# EAGLE design BLSpkAlwaysOnRobotV2 (EAGLE 9.7.0)

## Sheet 1 of 2
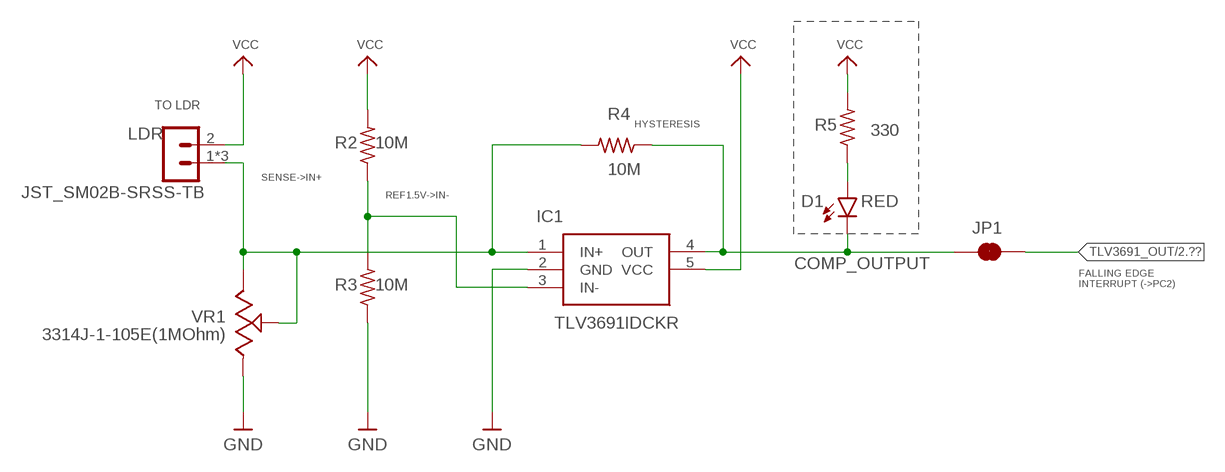
[diagram p0: schematic, sheet 1]

### Parts
D1  RED  LED_06030603  [LED-0603]
IC1  TLV3691IDCKR  [SOT65P210X110-5N]
JP1  JUMPER_SHORTED_NO-SILK  [JUMPER_SHORTED]
LDR  JST_SM02B-SRSS-TB  [JST_SM02B-SRSS-TB]
R2  10M  R-US-0603_CHIP-0603(1608-METRIC)  [RESC1608X60]
R3  10M  R-US-0603_CHIP-0603(1608-METRIC)  [RESC1608X60]
R4  10M  R-US-0603_CHIP-0603(1608-METRIC)  [RESC1608X60]
R5  330  R-US-0603_CHIP-0603(1608-METRIC)  [RESC1608X60]
VR1  3314J-1-105E(1MOhm)  3314J-1-105E  [TRIM_3314J-1-105E]

### Nets
COMP_OUTPUT: D1.C IC1.4(OUT) JP1.1 R4.1
GND: IC1.2(GND) R3.1 VR1.1(CCW) ; also sheet 2
N$1: D1.A R5.1
REF1.5V->IN-: IC1.3(IN-) R2.1 R3.2
SENSE->IN+: IC1.1(IN+) LDR.1 LDR.M1 LDR.M2 R4.2 VR1.2(WIPER) VR1.3(CW)
TLV3691_OUT: JP1.2 ; also sheet 2
VCC: IC1.5(VCC) LDR.2 R2.2 R5.2 ; also sheet 2

### Notes on the sheet
- TO LDR
- HYSTERESIS
- FALLING EDGE
  INTERRUPT (->PC2)

## Sheet 2 of 2
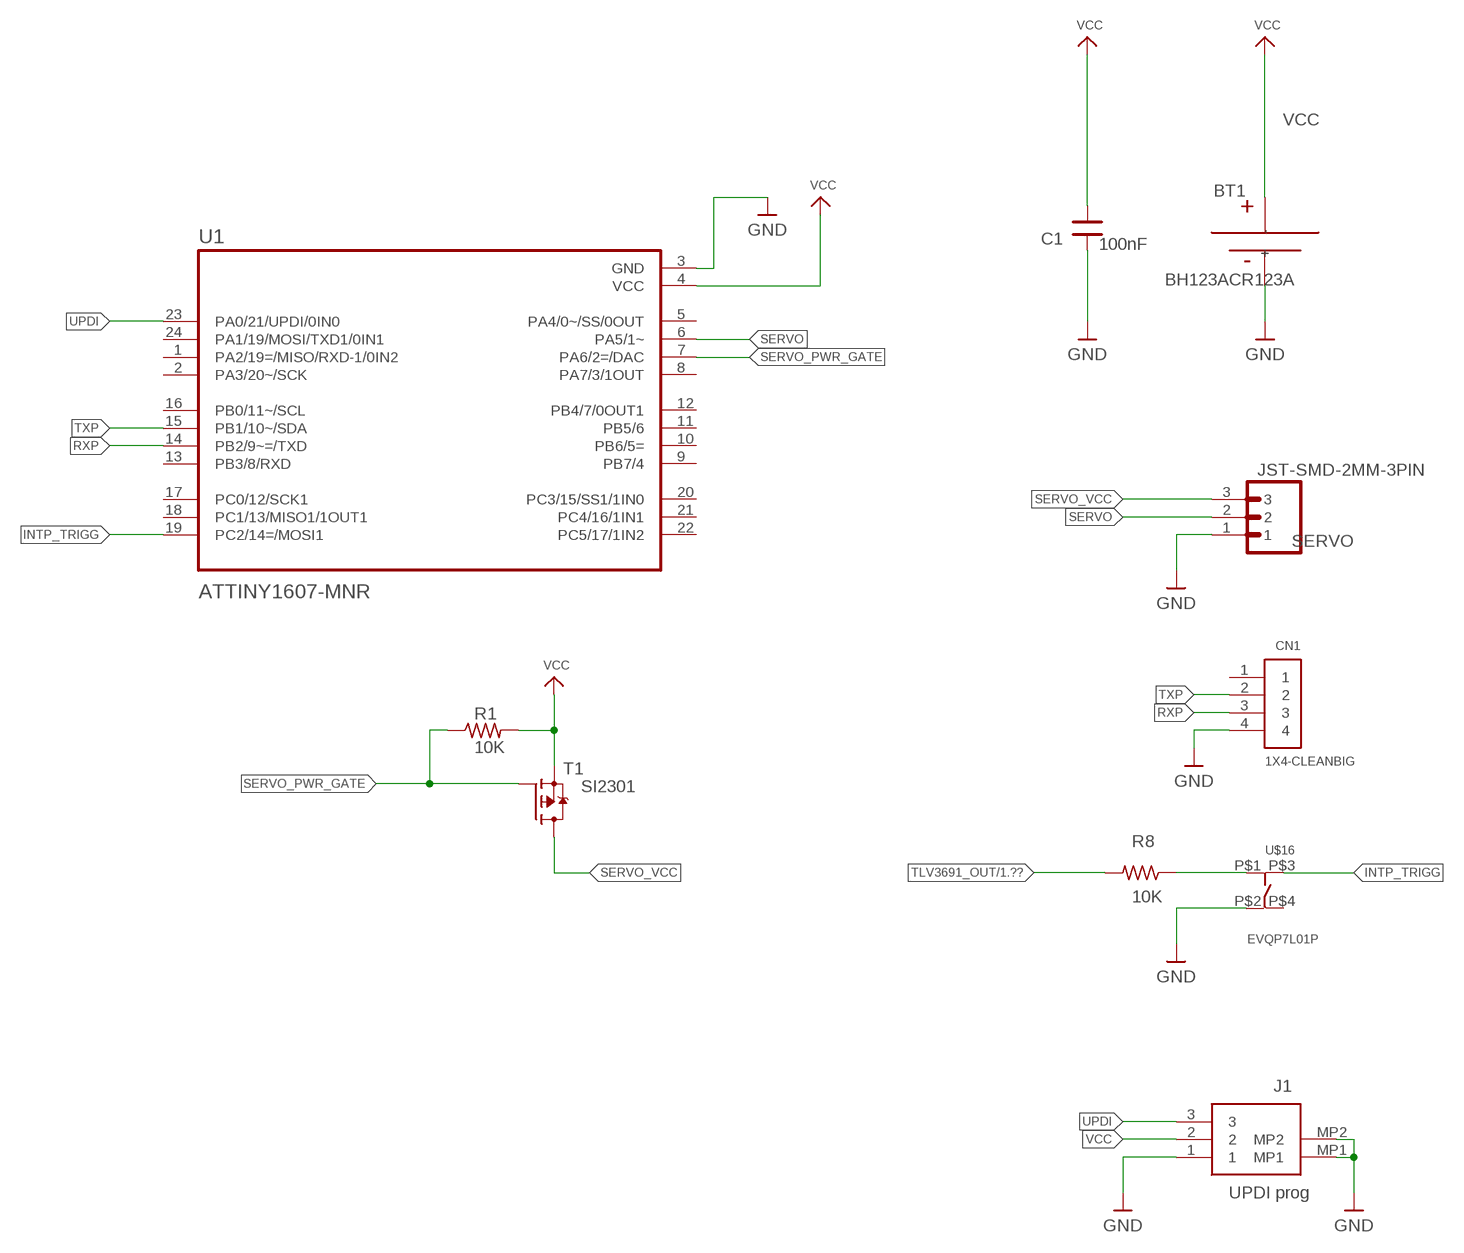
[diagram p1: schematic, sheet 2]

### Parts
BT1  BH123ACR123A  [BH123A]
C1  100nF  C_CHIP-0603(1608-METRIC)  [CAPC1608X85]
CN1  1X4-CLEANBIG  [1X04-CLEANBIG]
J1  UPDI prog  SM03B-SRSS-TB_LF__SN_  [SM03BSRSSTBLFSN]
R1  10K  R-US-0603_CHIP-0603(1608-METRIC)  [RESC1608X60]
R8  10K  R-US-0603_CHIP-0603(1608-METRIC)  [RESC1608X60]
SERVO  JST-SMD-2MM-3PIN  [JST-SMD-2MM-3PIN]
T1  SI2301  [SI2301_DESTO_SOT23]
U1  ATTINY1607-MNR  [QFN50P400X400X90-25N]
U$16  EVQP7L01P  [EVQP7L01P]

### Nets
GND: BT1.- C1.1 CN1.4 J1.1 J1.MP1 J1.MP2 SERVO.1 U1.3(GND) U$16.P$2 ; also sheet 1
INTP_TRIGG: U1.19(PC2/14=/MOSI1) U$16.P$3
N$3: R8.1 U$16.P$1
RXP: CN1.3 U1.14(PB2/9~=/TXD)
SERVO: SERVO.2 U1.6(PA5/1~)
SERVO_PWR_GATE: R1.1 T1.1(G) U1.7(PA6/2=/DAC)
SERVO_VCC: SERVO.3 T1.3(D)
TLV3691_OUT: R8.2 ; also sheet 1
TXP: CN1.2 U1.15(PB1/10~/SDA)
UPDI: J1.3 U1.23(PA0/21/UPDI/0IN0)
VCC: BT1.+ C1.2 J1.2 R1.2 T1.2(S) U1.4(VCC) ; also sheet 1
Unconnected: CN1.1 U1.1(PA2/19=/MISO/RXD-1/0IN2) U1.2(PA3/20~/SCK) U1.5(PA4/0~/SS/0OUT) U1.8(PA7/3/1OUT) U1.9(PB7/4) U1.10(PB6/5=) U1.11(PB5/6) U1.12(PB4/7/0OUT1) U1.13(PB3/8/RXD) U1.16(PB0/11~/SCL) U1.17(PC0/12/SCK1) U1.18(PC1/13/MISO1/1OUT1) U1.20(PC3/15/SS1/1IN0) U1.21(PC4/16/1IN1) U1.22(PC5/17/1IN2) U1.24(PA1/19/MOSI/TXD1/0IN1) U$16.P$4

## Library data of the parts
BT1 = BLSpeakerAlwaysOnRobot:BH123A: collection of battery footprints
C1 = BLSpeakerAlwaysOnRobot:C: Capacitor - Generic
CN1 = adafruit:1X4: 4-pin connector
D1 = BLSpeakerAlwaysOnRobot:LED_0603: Green SMD LED Used in manufacturing of various products at SparkFun Packages: 0603 - SMD 0603 package [Product Link] <http://www.futureelectronics.com/en/technologies/semiconductors/optoelectronics/leds/Pages/9894312-LTST-C190GKT.aspx?CrossPart=HSMG-C190&IM=0> LilyPad 1206 - SMD1206 LilyPad package [Product Link] <http://www.futureelectronics.com/en/Technologies/Product.aspx?ProductID=IN150NGHARVATEKCORPORATION2049943&IM=0> 1206 - SMD1206 package [Product Link] <http://www.futureelectronics.com/en/technologies/semiconductors/optoelectronics/leds/Pages/8315665-LTST-C150KGKT.aspx?IM=0> 1206 Bottom Mount -SMD 1206 Bottom Mount [Product Link] <http://www.digikey.com/product-detail/en/lite-on-inc/LTST-C230KGKT/160-1456-1-ND/386854> SparkFun Products: Pro Mini 328 -5V <https://www.sparkfun.com/products/821> RedBoard <https://www.sparkfun.com/products/12757> MP3 Trigger <https://www.sparkfun.com/products/13720> Makey Makey <https://www.sparkfun.com/products/11076>
IC1 = BLSpeakerAlwaysOnRobot:TLV3691IDCKR: Lowest Power, 0.9V to 6.5V, Small Size Comparator Source: Datasheet <http://www.ti.com/lit/gpn/tlv3691>
J1 = BLSpeakerAlwaysOnRobot:SM03B-SRSS-TB_LF__SN_: Wire To Board / Wire To Wire Connector RoHS Source: Datasheet <http://www.jst-mfg.com/product/pdf/eng/eSR.pdf>
JP1 = BLSpeakerAlwaysOnRobot:JUMPER_SHORTED: Normally closed trace jumper This jumper has a trace between two pads so it's normally closed (NC). Use a razor knife to open the connection. For best results follow the IPC guidelines for cutting traces: Cutout at least 0.063 mm (0.005 in). Remove all loose material to clean up the cut area. Seal the cut with an approved epoxy. Reapply solder to reclose the connection.
LDR = BLSpeakerAlwaysOnRobot:JST_SM02B-SRSS-TB
R1-R5 R8 = BLSpeakerAlwaysOnRobot:R-US-0603: Resistor Fixed - ANSI
SERVO = BLSpeakerAlwaysOnRobot:JST-SMD-2MM-3PIN
T1 = BLSpeakerAlwaysOnRobot:SI2301: Check availability <https://pricing.snapeda.com/parts/SI2301/Vishay%20Siliconix/view-part?ref=eda>
U1 = BLSpeakerAlwaysOnRobot:ATTINY1607-MNR: None Check prices <https://pricing.snapeda.com/parts/ATTINY1607-MNR/Microchip%20Technology/view-part?ref=eda>
U$16 = MY_BUTTONS:EVQP7L01P
VR1 = BLSpeakerAlwaysOnRobot:3314J-1-105E

## Board
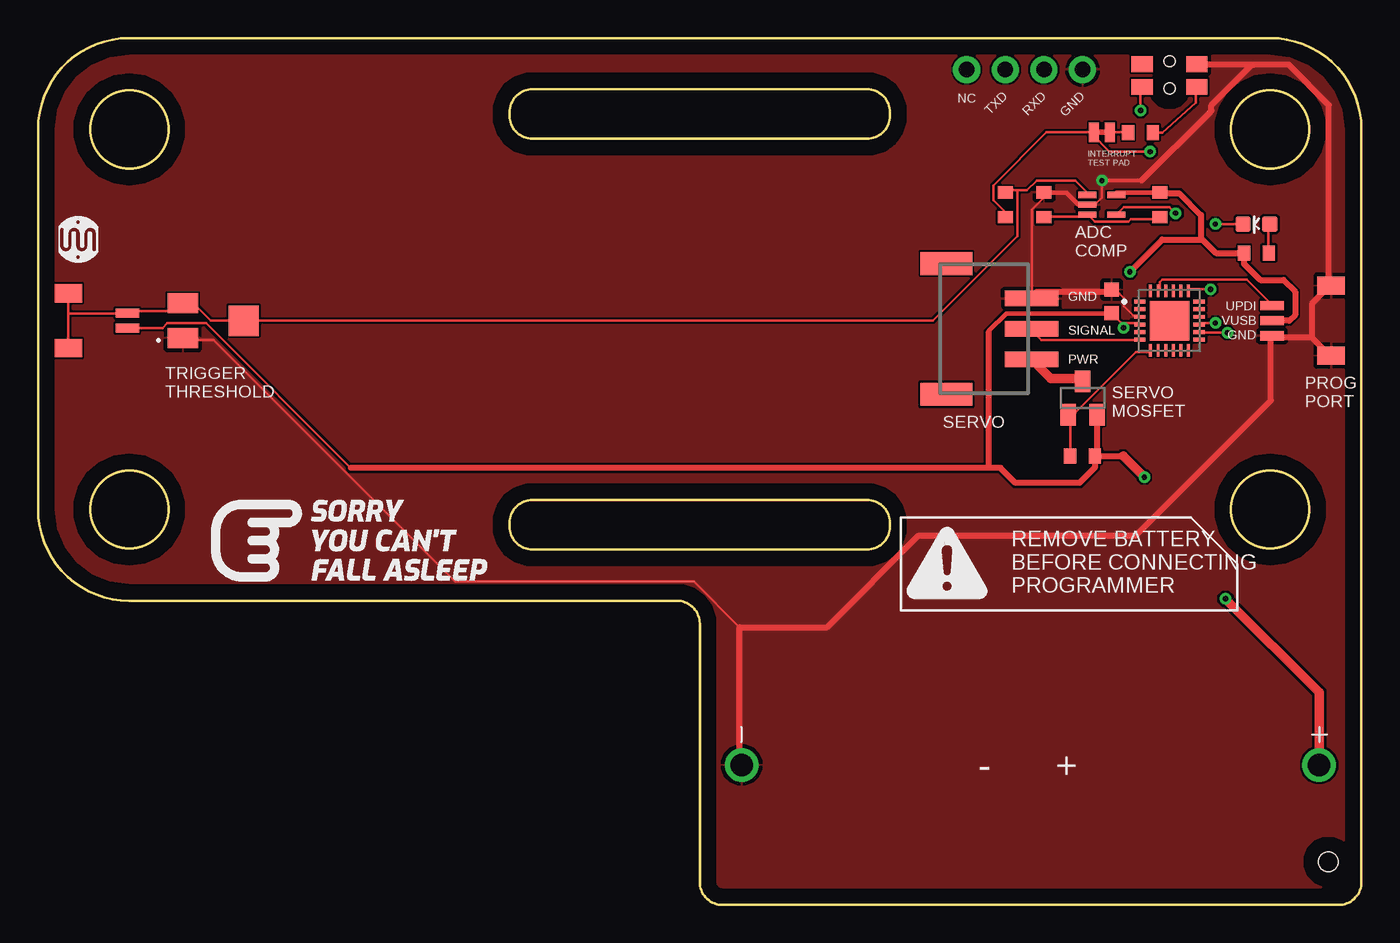
[diagram p2: board, top side]
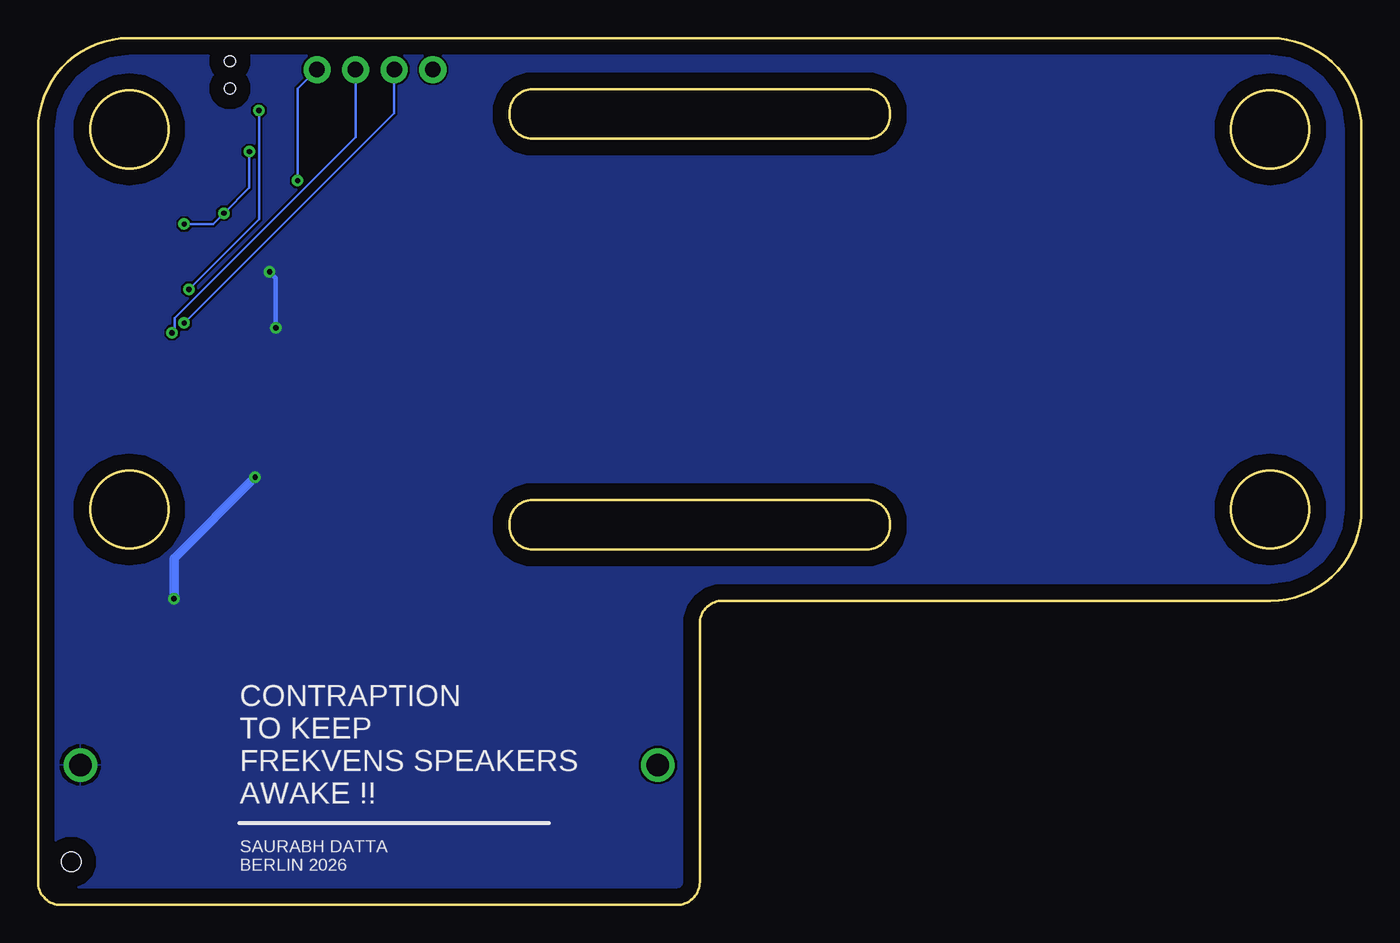
[diagram p3: board, bottom side, seen from below]

Size 87 x 57 mm. Coordinates in mm from the lower left corner, seen from the top.
Outline: 31,51.87 arc90 32.5,50.37 54.5,50.37 arc90 56,51.87 56,52.12 arc90 54.5,53.62 32.5,53.62 arc90 31,52.12 31,51.87
Outline: 32.5,26.62 arc90 31,25.12 31,24.87 arc90 32.5,23.37 54.5,23.37 arc90 56,24.87 56,25.12 arc90 54.5,26.62 32.5,26.62
Outline: 43.5,1.5 arc90 45,0 85.5,0 arc90 87,1.5 87,51 arc90 81,57 6,57 arc90 0,51 0,26 arc90 6,20 42,20 arc-90 43.5,18.5 43.5,1.5
Outline: circle at 81,51 radius 2.56
Outline: circle at 6,26 radius 2.56
Outline: circle at 6,51 radius 2.56
Outline: circle at 81,26 radius 2.56
Copper layers (1*16): Top / Bottom
Stack-up Default Layer Stack: Top SilkScreen Epoxy Ink / Top SolderMask User Defined 0.0254mm Dk 4.3 / Top Surface Finish Lead-Free 0.02mm / Top CuFoil:007 0.035mm / Dielectric-1 User Defined 1.5mm / Bottom CuFoil:007 0.035mm / Bottom Surface Finish Lead-Free 0.02mm / Bottom SolderMask User Defined 0.0254mm Dk 4.3 / Bottom SilkScreen Epoxy Ink
Design rules: minimum drill size 0.35mm, minimum copper width 6mil, keepout clearance 0mil, drill distance 6mil, via restrict clearance 0mil, dimension clearance 40mil, restrict clearance 0mil, copper clearance wire_polygon to wire_polygon 6mil, copper clearance wire_polygon to pad_smd 6mil, copper clearance wire_polygon to via 6mil, copper clearance pad_smd to pad_smd 6mil, copper clearance pad_smd to via 6mil, copper clearance via to via 6mil, copper clearance smd to pad (same net) 6mil, copper clearance smd to via (same net) 6mil, copper clearance smd to smd (same net) 6mil

### Footprints (pad centres in the part's own frame; a part is rotated, then mirrored left to right if it is on the bottom)
BH123A = drill 1.47: + 18.985,0; - -18.985,0 | hole 1.27: 19.58,-6.37
CAPC1608X85 = smd 0.921 x 0.97: 1 -0.775,0; 2 0.775,0
1X04-CLEANBIG = drill 1.016 pad 1.778: 1 -3.81,0; 2 -1.27,0; 3 1.27,0; 4 3.81,0
LED-0603 = smd 1 x 1: A -0.877,0; C 0.877,0
SOT65P210X110-5N = smd 1.2 x 0.4: 1 -0.95,0.65; 2 -0.95,0; 3 -0.95,-0.65; 4 0.95,-0.65; 5 0.95,0.65
SM03BSRSSTBLFSN = smd 0.6 x 1.55: 1 -1,2.463; 2 0,2.463; 3 1,2.463 | smd 1.2 x 1.8: MP1 -2.3,-1.413; MP2 2.3,-1.413
JUMPER_SHORTED = smd 0.66 x 1.27: 1 -0.521,0; 2 0.521,0
JST_SM02B-SRSS-TB = smd 0.6 x 1.55: 1 0.5,0; 2 -0.5,0 | smd 1.2 x 1.8: M1 1.8,3.875; M2 -1.8,3.875
RESC1608X60 = smd 0.799 x 0.974: 1 -0.815,0; 2 0.815,0
JST-SMD-2MM-3PIN = smd 1 x 3.5: 1 -4,3; 2 -2,3; 3 0,3 | smd 1.5 x 3.4: P$1 -6.3,-2.6; P$2 2.3,-2.6
SI2301_DESTO_SOT23 = smd 1 x 1.4: 1 -0.95,-1.1; 2 0.95,-1.1; 3 0,1.1
QFN50P400X400X90-25N = smd 0.81 x 0.26: 1 -1.95,1.25; 2 -1.95,0.75; 3 -1.95,0.25; 4 -1.95,-0.25; 5 -1.95,-0.75; 6 -1.95,-1.25; 13 1.95,-1.25; 14 1.95,-0.75; 15 1.95,-0.25; 16 1.95,0.25; 17 1.95,0.75; 18 1.95,1.25 | smd 0.26 x 0.81: 7 -1.25,-1.95; 8 -0.75,-1.95; 9 -0.25,-1.95; 10 0.25,-1.95; 11 0.75,-1.95; 12 1.25,-1.95; 19 1.25,1.95; 20 0.75,1.95; 21 0.25,1.95; 22 -0.25,1.95; 23 -0.75,1.95; 24 -1.25,1.95 | smd 2.6 x 2.6: 25 0,0
EVQP7L01P = smd 1.4 x 1.05: P$1 -1.8,0.8; P$2 -1.8,-0.71; P$3 1.8,0.8; P$4 1.8,-0.71 | hole 0.7: 0,0.9; 0,-0.9
TRIM_3314J-1-105E = smd 1.3 x 2: 1 1.15,-2; 3 -1.15,-2 | smd 2 x 2: 2 0,2

### Placement (x,y rotation side)
BT1  65.24,9.21 0 top
C1  70.57,39.69 270 top
CN1  64.86,54.93 0 top
D1  80.1,44.77 180 top
IC1  69.94,46.04 0 top
J1  83.59,38.42 90 top
JP1  69.94,50.8 0 top
LDR  5.87,38.42 90 top
R1  68.67,29.53 0 top
R2  73.75,46.04 90 top
R3  66.13,46.04 270 top
R4  63.59,46.04 90 top
R5  80.1,42.86 180 top
R8  72.48,50.78 180 top
SERVO  62.32,35.88 270 top
T1  68.67,33.34 0 top
U1  74.38,38.42 0 top
U$16  74.38,54.58 180 top
VR1  11.52,38.42 270 top

### Tracks (layer width: path | path; a pad name or v marks a point on that pad's centre or on a via)
COMP_OUTPUT  (via drill 0.35)
  Top 0.152: D1.C v77.4,44.77 | IC1.4 70.89,45.4 71.36,45.88 74.38,45.88 v74.78,45.48 | R4.1 63.59,45.56 62.79,46.35 62.79,47.31 66.28,50.8 69.3,50.8 | v73.11,49.53 70.44,49.53 69.3,50.67 69.3,50.8 | JP1.1 69.3,50.8
  Bottom 0.152: v77.4,44.77 75.49,44.77 v74.78,45.48 73.11,47.15 v73.11,49.53
GND  (via drill 0.35)
  Top 0.152: 68.51,46.04 IC1.2 69.46,46.04 69.94,46.51 v69.94,47.63 | U1.3 72.32,38.73 72,38.73 71.36,39.37 71.36,39.91 71.08,40.2 70.7,40.2 70.57,40.32 C1.1 | 65.33,40.01 65.65,40.32 | 65.33,40.01 65.33,45.72 66.13,46.51 66.13,46.83 R3.1 | 65.33,40.01 SERVO.1 | 81.21,37.31 J1.1 81.05,37.31 | 84.86,36.19 J1.MP1 | 76.29,55.25 U$16.P$2 | 84.86,40.8 J1.MP2 84.86,40.64 | 46.12,18.26 43.11,21.27 27.41,21.27 11.54,37.15 9.61,37.15 VR1.1 | 46.12,9.21 BT1.-
  Top 0.254: 72.54,47.63 v69.94,47.63
  Top 0.305: 66.13,46.83 67.61,46.83 68.4,46.04 68.51,46.04
  Top 0.406: 65.65,40.32 70.57,40.32 | 83.75,37.31 81.21,37.31 | 84.86,36.19 83.75,37.31 | 79.79,55.25 76.29,55.25 | 83.75,37.31 83.75,39.53 84.86,40.64 | 46.12,9.21 46.12,18.26 51.85,18.26 57.88,24.29 72.16,24.29 81.05,33.18 81.05,37.31 | 84.86,40.8 84.86,52.6 82.21,55.25 79.97,55.25 79.79,55.25 | 72.54,47.63 76.98,52.07 77.14,52.23 77.14,52.6 79.79,55.25
  Bottom 0.152: CN1.4 69.94,53.66 v69.94,47.63
  pour Top: -2.45,61.28 88.99,61.28 88.99,-6.03 39.46,-6.03 39.46,16.83 -2.45,16.83
INTP_TRIGG  (via drill 0.35)
  Top 0.152: v77.08,40.48 75.65,40.48 U1.19 | v72.48,52.23 72.48,53.66 U$16.P$3
  Bottom 0.152: v77.08,40.48 72.48,45.08 v72.48,52.23
N$1
  Top 0.152: R5.1 80.89,42.86 80.89,44.77 D1.A
N$3
  Top 0.152: R8.1 73.92,50.78 76.13,52.74 76.13,53.66 U$16.P$1
REF1.5V->IN-
  Top 0.152: R3.2 66.13,45.24 68.98,45.24 IC1.3 69.14,45.24 69.46,44.93 71.68,44.93 71.84,45.08 73.75,45.08 R2.1
RXP  (via drill 0.35)
  Top 0.152: v78.19,37.62 76.44,37.62 U1.14
  Bottom 0.152: v78.19,37.62 78.03,37.78 78.03,38.58 66.13,50.48 CN1.3
SENSE->IN+
  Top 0.152: 1.99,38.89 1.99,40.16 LDR.M1 | 1.99,38.89 1.99,36.67 LDR.M2 | 64.38,46.99 65.01,46.99 65.65,47.63 68.19,47.63 68.98,46.83 IC1.1 | 64.38,46.99 63.59,46.99 R4.2 | 64.38,46.99 64.38,43.97 58.82,38.42 VR1.2 11.36,38.42 10.25,39.53 9.61,39.53 VR1.3 9.45,39.53 8.98,39.05 5.96,39.05 LDR.1 5.8,38.89 1.99,38.89
SERVO
  Top 0.152: U1.6 72.32,37.15 65.97,37.15 65.33,37.78 SERVO.2
SERVO_PWR_GATE
  Top 0.152: U1.7 73.11,36.35 72.16,36.35 68.19,32.39 67.87,32.39 T1.1 67.87,32.23 67.87,29.53 R1.1
SERVO_VCC
  Top 0.61: T1.3 68.5,34.61 66.59,34.61 SERVO.3
TLV3691_OUT
  Top 0.152: R8.2 71.64,50.8 JP1.2
TXP  (via drill 0.35)
  Top 0.152: v77.4,38.26 76.44,38.26 U1.15
  Bottom 0.152: v77.4,38.26 63.59,52.07 CN1.2
UPDI
  Top 0.152: U1.23 73.75,40.48 73.75,40.96 73.9,41.12 79.46,41.12 81.05,39.53 J1.3
VCC  (via drill 0.35)
  Top 0.152: 70.89,46.83 IC1.5 | 73.75,46.83 R2.2 | 71.36,38.26 71.21,38.26 70.57,38.89 C1.2 | 71.36,38.26 72.32,38.26 U1.4 | 20.56,28.73 11.04,38.26 8.5,38.26 8.18,37.94 5.96,37.94 LDR.2 | 71.36,38.26 v71.36,37.94
  Top 0.305: 70.89,46.83 73.75,46.83 | 62.51,37.66 62.51,37.75 63.65,38.89 70.57,38.89
  Top 0.406: 62.51,28.73 63.27,28.73 64.25,27.75 68.46,27.75 69.48,28.77 R1.2 | 62.51,28.73 20.56,28.73 | 62.51,28.73 62.51,37.66 | J1.2 82.25,38.42 82.64,38.8 82.64,40.32 81.87,41.08 80.35,41.08 79.28,42.15 R5.2 77.43,42.86 76.44,43.85 | R2.2 73.8,46.8 75.02,46.8 76.44,45.37 76.44,43.85 | 76.44,43.85 76.44,43.75 73.9,43.75 v71.78,41.62 | T1.2 69.62,29.66 R1.2 | R1.2 71.33,29.53
  Top 0.61: 71.33,29.53 v72.73,28.13 | v78.06,20.13 84.22,13.97 BT1.+
  Bottom 0.305: v71.78,41.62 71.36,41.21 v71.36,37.94
  Bottom 0.61: v72.73,28.13 78.06,22.8 v78.06,20.13
  pour Bottom: -1.18,58.74 87.72,58.74 87.72,-3.49 43.27,-3.49 43.27,-0.95 42,-0.95 42,18.1 -1.18,18.1

### Text on the board
SilkscreenTop: NC | TXD | RXD | GND | INTERRUPT / TEST PAD | ADC / COMP | GND | UPDI | VUSB | SIGNAL | GND | PWR | TRIGGER / THRESHOLD | SERVO / MOSFET | PROG / PORT | SERVO | REMOVE BATTERY / BEFORE CONNECTING / PROGRAMMER | - | +
SilkscreenBottom: CONTRAPTION / TO KEEP / FREKVENS SPEAKERS / AWAKE !! | SAURABH DATTA / BERLIN 2026